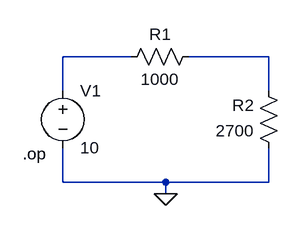
[diagram p0: schematic Maximum Power.asc]
Maximum Power.asc, the LTspice schematic file:
Version 4
SHEET 1 880 680
WIRE 384 160 288 160
WIRE 576 160 464 160
WIRE 288 208 288 160
WIRE 576 208 576 160
WIRE 288 336 288 288
WIRE 432 336 288 336
WIRE 576 336 576 288
WIRE 576 336 432 336
WIRE 432 352 432 336
FLAG 432 352 0
SYMBOL voltage 288 192 R0
SYMATTR InstName V1
SYMATTR Value 10
SYMBOL res 480 144 R90
WINDOW 0 0 56 VBottom 2
WINDOW 3 32 56 VTop 2
SYMATTR InstName R1
SYMATTR Value 1000
SYMBOL res 592 304 R180
WINDOW 0 36 76 Left 2
WINDOW 3 36 40 Left 2
SYMATTR InstName R2
SYMATTR Value 2700
TEXT 232 296 Left 2 !.op

The netlist it stands for:
* Maximum Power.asc
V1 N001 0 10
R1 N002 N001 1000
R2 0 N002 2700
.op
.backanno
.end